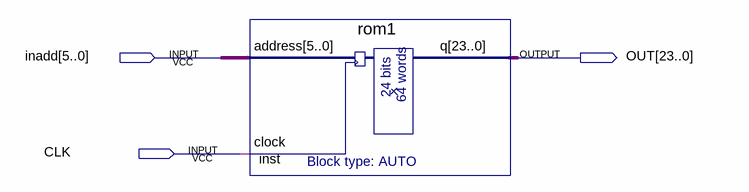
[diagram p0: schematic sheet]
// Quartus schematic exp7.bdf as structural Verilog: 1 symbols, 3 pins
module exp7 (
  input  [5:0] inadd,
  input  CLK,
  output [23:0] OUT
);

  rom1 inst (.address(inadd), .clock(CLK), .q(OUT));
endmodule
